# Altium schematic sheet Signal_RX.SchDoc: Signal_RX
size A4; DocumentNumber: 2; SheetNumber: 2; SheetTotal: 8
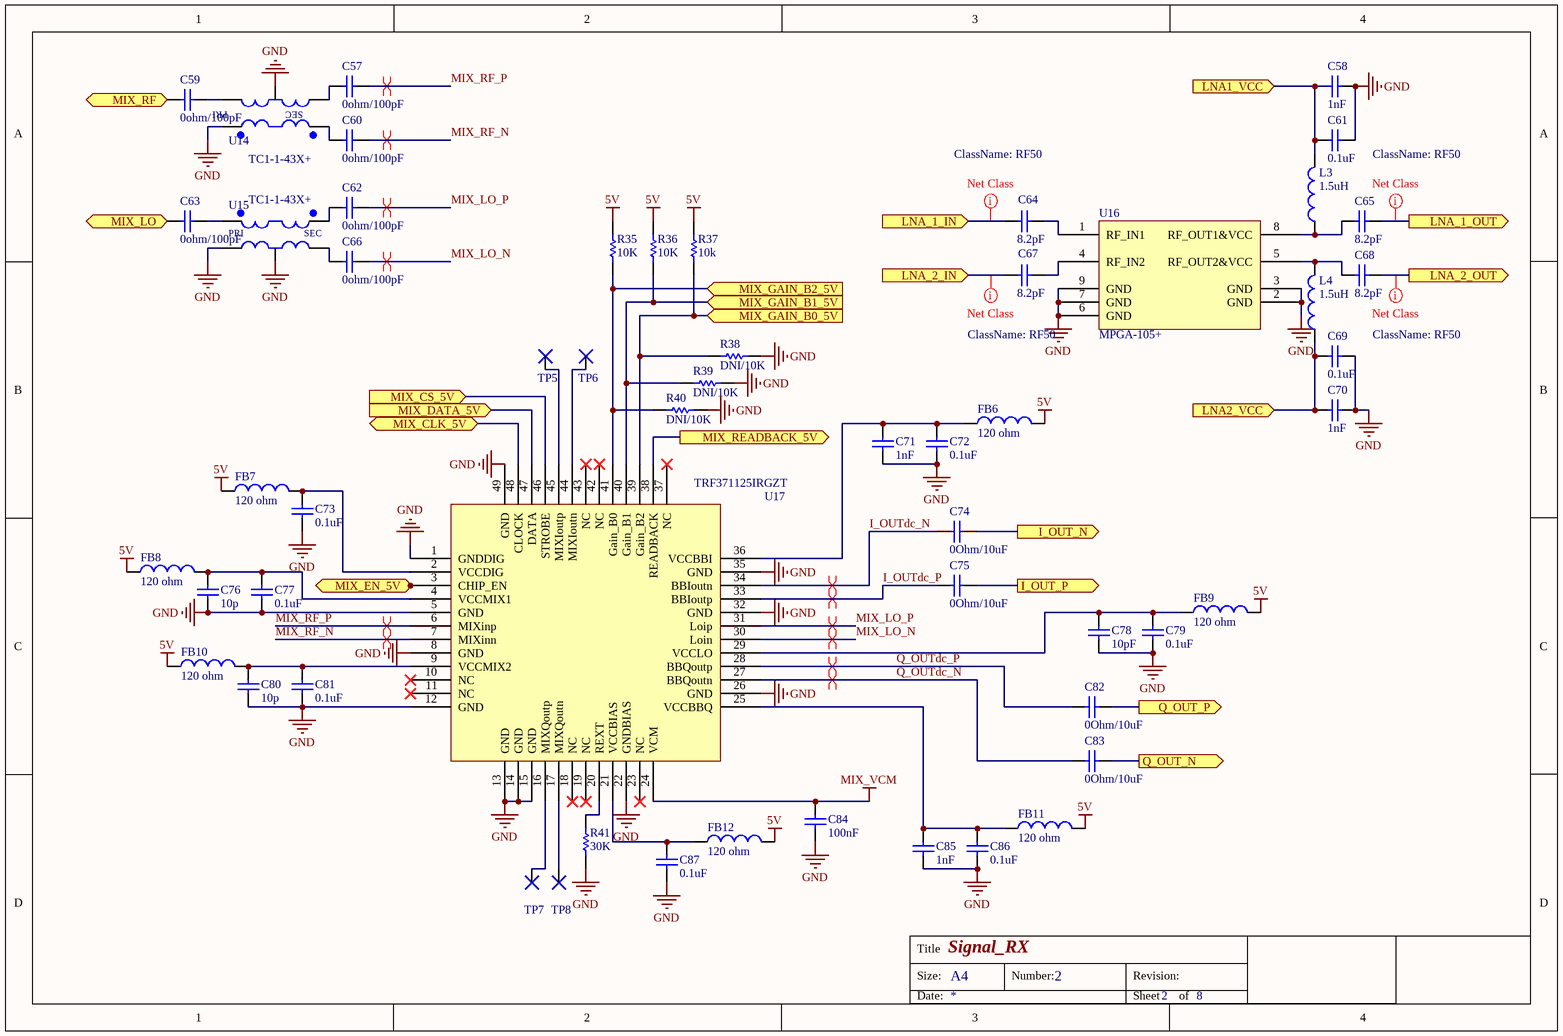
[diagram p0: Signal_RX.SchDoc]

## Parts
C57  0ohm/100pF  [0603 Cap]
C58  1nF  [0603 Cap]
C59  0ohm/100pF  [0603 Cap]
C60  0ohm/100pF  [0603 Cap]
C61  0.1uF  [0603 Cap]
C62  0ohm/100pF  [0603 Cap]
C63  0ohm/100pF  [0603 Cap]
C64  8.2pF  [Chip2PinSM127P600-8N_CAP0402]
C65  8.2pF  [Chip2PinSM127P600-8N_CAP0402]
C66  0ohm/100pF  [0603 Cap]
C67  8.2pF  [Chip2PinSM127P600-8N_CAP0402]
C68  8.2pF  [Chip2PinSM127P600-8N_CAP0402]
C69  0.1uF  [0603 Cap]
C70  1nF  [0603 Cap]
C71  1nF  [0603 Cap]
C72  0.1uF  [0603 Cap]
C73  0.1uF  [0603 Cap]
C74  0Ohm/10uF  [0603 Cap]
C75  0Ohm/10uF  [0603 Cap]
C76  10p  [0603 Cap]
C77  0.1uF  [0603 Cap]
C78  10pF  [0603 Cap]
C79  0.1uF  [0603 Cap]
C80  10p  [0603 Cap]
C81  0.1uF  [0603 Cap]
C82  0Ohm/10uF  [0603 Cap]
C83  0Ohm/10uF  [0603 Cap]
C84  100nF  [0603 Cap]
C85  1nF  [0603 Cap]
C86  0.1uF  [0603 Cap]
C87  0.1uF  [0603 Cap]
FB6  120 ohm  [INDC1608X08L]
FB7  120 ohm  [INDC1608X08L]
FB8  120 ohm  [INDC1608X08L]
FB9  120 ohm  [INDC1608X08L]
FB10  120 ohm  [INDC1608X08L]
FB11  120 ohm  [INDC1608X08L]
FB12  120 ohm  [INDC1608X08L]
L3  1.5uH  [INDC1008X07L]
L4  1.5uH  [INDC1008X07L]
R35  10K  [0603 Res]
R36  10K  [0603 Res]
R37  10k  [0603 Res]
R38  DNI/10K  [0603 Res]
R39  DNI/10K  [0603 Res]
R40  DNI/10K  [0603 Res]
R41  30K  [0603 Res]
TP5  TEST_POINT_PIN  [TESTPOINT]  (value not drawn)  (no BOM)
TP6  TEST_POINT_PIN  [TESTPOINT]  (value not drawn)  (no BOM)
TP7  TEST_POINT_PIN  [TESTPOINT]  (value not drawn)  (no BOM)
TP8  TEST_POINT_PIN  [TESTPOINT]  (value not drawn)  (no BOM)
U14  TC1-1-43X+  [AT1521]
U15  TC1-1-43X+  [AT1521]
U16  MPGA-105+  [DL1020_recomendedValues]
U17  TRF371125IRGZT  [QFN50P700X700X100_HS-49M]

## Ports
I_OUT_N (out), I_OUT_P (out), LNA1_VCC (in), LNA2_VCC (in), LNA_1_IN (in), LNA_1_OUT (out), LNA_2_IN (in), LNA_2_OUT (out), MIX_CLK_5V (bidir), MIX_CS_5V (in), MIX_DATA_5V (in), MIX_EN_5V (in), MIX_GAIN_B0_5V (in), MIX_GAIN_B1_5V (in), MIX_GAIN_B2_5V (in), MIX_LO (in), MIX_READBACK_5V (out), MIX_RF (in), Q_OUT_N (out), Q_OUT_P (out)

## Nets
5V: FB6.1 FB7.1 FB8.1 FB9.1 FB10.1 FB11.1 FB12.1 R35.2 R36.2 R37.2
GND: C58.1 C61.1 C69.2 C70.2 C71.2 C72.2 C73.1 C76.1 C77.1 C78.2 C79.2 C80.1 C81.1 C84.2 C85.2 C86.2 C87.2 R38.1 R39.1 R40.1 R41.1 U14.2(NC) U14.6 U15.2(NC) U15.4 U16.2(GND) U16.3(GND) U16.6(GND) U16.7(GND) U16.9(GND) U17.1(GNDDIG) U17.5(GND) U17.8(GND) U17.12(GND) U17.13(GND) U17.14(GND) U17.15(GND) U17.22(GNDBIAS) U17.26(GND) U17.32(GND) U17.35(GND) U17.49(GND)
MIX_VCM: C84.1 U17.24(VCM)
I_OUT_N: C74.1 ; port I_OUT_N
I_OUT_P: C75.1 ; port I_OUT_P
I_OUTdc_N: C74.2 U17.34(BBIoutn)
I_OUTdc_P: C75.2 U17.33(BBIoutp)
LNA1_VCC: C58.2 C61.2 L3.2 ; port LNA1_VCC
LNA2_VCC: C69.1 C70.1 L4.2 ; port LNA2_VCC
LNA_1_IN: C64.1 ; port LNA_1_IN
LNA_1_OUT: C65.2 ; port LNA_1_OUT
LNA_2_IN: C67.1 ; port LNA_2_IN
LNA_2_OUT: C68.2 ; port LNA_2_OUT
MIX_CLK_5V: U17.48(CLOCK) ; port MIX_CLK_5V
MIX_CS_5V: U17.46(STROBE) ; port MIX_CS_5V
MIX_DATA_5V: U17.47(DATA) ; port MIX_DATA_5V
MIX_GAIN_B0_5V: R37.1 R38.2 U17.39(Gain_B2) ; port MIX_GAIN_B0_5V
MIX_GAIN_B1_5V: R36.1 R39.2 U17.40(Gain_B1) ; port MIX_GAIN_B1_5V
MIX_GAIN_B2_5V: R35.1 R40.2 U17.41(Gain_B0) ; port MIX_GAIN_B2_5V
MIX_LO: C63.1 ; port MIX_LO
MIX_LO_N: C66.2 U17.30(Loin)
MIX_LO_P: C62.2 U17.31(Loip)
MIX_READBACK_5V: U17.38(READBACK) ; port MIX_READBACK_5V
MIX_RF: C59.1 ; port MIX_RF
MIX_RF_N: C60.2 U17.7(MIXinn)
MIX_RF_P: C57.2 U17.6(MIXinp)
Q_OUT_N: C83.1 ; port Q_OUT_N
Q_OUT_P: C82.1 ; port Q_OUT_P
Q_OUTdc_N: C83.2 U17.27(BBQoutn)
Q_OUTdc_P: C82.2 U17.28(BBQoutp)
NetC57_1: C57.1 U14.3
NetC59_2: C59.2 U14.4
NetC60_1: C60.1 U14.1
NetC62_1: C62.1 U15.1
NetC63_2: C63.2 U15.6
NetC64_2: C64.2 U16.1(RF_IN1)
NetC65_1: C65.1 L3.1 U16.8(RF_OUT1&VCC)
NetC66_1: C66.1 U15.3
NetC67_2: C67.2 U16.4(RF_IN2)
NetC68_1: C68.1 L4.1 U16.5(RF_OUT2&VCC)
NetC71_1: C71.1 C72.1 FB6.2 U17.36(VCCBBI)
NetC73_2: C73.2 FB7.2 U17.2(VCCDIG)
NetC76_2: C76.2 C77.2 FB8.2 U17.4(VCCMIX1)
NetC78_1: C78.1 C79.1 FB9.2 U17.29(VCCLO)
NetC80_2: C80.2 C81.2 FB10.2 U17.9(VCCMIX2)
NetC85_1: C85.1 C86.1 FB11.2 U17.25(VCCBBQ)
NetC87_1: C87.1 FB12.2 U17.21(VCCBIAS)
NetR41_2: R41.2 U17.20(REXT)
NetTP5_1: TP5.1 U17.45(MIXIoutp)
NetTP6_1: TP6.1 U17.44(MIXIoutn)
NetTP7_1: TP7.1 U17.16(MIXQoutp)
NetTP8_1: TP8.1 U17.17(MIXQoutn)

Not connected (* = marked no-connect by the designer): U17 3(CHIP_EN) 10(NC)* 11(NC)* 18(NC)* 19(NC)* 23(NC)* 37(NC)* 42(NC)* 43(NC)*

## Layout directives
differential pair: I_OUTdc_N, I_OUTdc_P, MIX_LO_N, MIX_LO_P, MIX_RF_N, MIX_RF_P, Q_OUTdc_N, Q_OUTdc_P
net class RF50: LNA_1_IN, LNA_1_OUT, LNA_2_IN, LNA_2_OUT

## Notes on the sheet
- Title
- Size:
- A4
- Number:
- Revision:
- Date:
- Sheet
- of
- (in symbol TC1-1-43X+) PRI; SEC

## Library data of the parts
C57-C63 C66 C69-C87 = C_0603: CAP CER 16V X7R 0603; Tolerance: 10; Voltage Rating: 16; Material: Ceramic; Mount: Surface Mount; Case/Package: 0603; Case Code (Metric): 1608; Case Code (Imperial): 0603; Capacitance: *; Dielectric: X7R; Voltage Rating (DC): 16; Termination: SMD; Composition: Ceramic; Voltage: 16; Length: 1.6; Height: 0.8; Width: 0.8; Thickness: 0.035; Depth: 0.8
C64 C65 C67 C68 = 04025A8R2BAT2A: CAP CER 8.2PF 50V NP0 0402; Manufacturer: AVX Corporation; Tolerance: ±0.1pF; Temperature Coefficient: C0G, NP0; Notification: Current market demand for these product types have resulted in fluctuating and extending lead times. Lead times may differ.; Supplier 1: Digi-Key; Manufacturer Part Number: 04025A8R2BAT2A; RoHS: RoHS Compliant; Category: Capacitors; Stock 1: 20781; Pricing 1: 1=0.09, 10=0.046, 100=0.0204, 500=0.0146, 1000=0.01148, 2500=0.01043, 5000=0.0096 (EUR); Packaging: Cut Tape (CT); Part Status: Active; Voltage - Rated: 50V; Operating Temperature: -55°C ~ 125°C; Features: -; Ratings: -; Applications: General Purpose; Failure Rate: -; Mounting Type: Surface Mount, MLCC; Package / Case: 0402 (1005 Metric); Size / Dimension: 0.039" L x 0.020" W (1.00mm x 0.50mm); Height - Seated (Max): -; Thickness (Max): 0.022" (0.56mm); Lead Spacing: -; Lead Style: -; ComponentLink1URL: http://datasheets.avx.com/C0GNP0-Dielectric.pdf; ComponentLink1Description: http://datasheets.avx.com/C0GNP0-Dielectric.pdf; Supplier Part Number 1: 478-10785-1-ND
FB6-FB12 = BLM18PG121SN1D: FERRITE BEAD 120 OHM 0603 1LN; Manufacturer: Murata Electronics North America; Filter Type: Power Line; Number of Lines: 1; Impedance @ Frequency: 120 Ohm @ 100MHz; Current Rating (Max): 2A; DC Resistance (DCR) (Max): 50 mOhm; Supplier 1: Digi-Key; Manufacturer Part Number: BLM18PG121SN1D; RoHS: RoHS Compliant; Category: Filters; Stock 1: 1305577; Pricing 1: 1=0.09, 10=0.067, 25=0.06, 50=0.0438, 100=0.038, 250=0.02996, 500=0.0253, 1000=0.02132 (EUR); Packaging: Cut Tape (CT); Part Status: Active; Ratings: -; Operating Temperature: -55°C ~ 125°C; Package / Case: 0603 (1608 Metric); Mounting Type: Surface Mount; Height (Max): 0.037" (0.95mm); Size / Dimension: 0.063" L x 0.031" W (1.60mm x 0.80mm); ComponentLink1URL: http://www.murata.com/en-us/products/productdata/8796738650142/ENFA0003.pdf; ComponentLink1Description: http://www.murata.com/en-us/products/productdata/8796738650142/ENFA0003.pdf; Supplier Part Number 1: 490-1037-1-ND
L3 L4 = AISC-1008F-1R5G-T: FIXED IND 1.5UH 630MA 760 MOHM; Manufacturer: Abracon LLC; Type: Wirewound; Material - Core: Ferrite; Tolerance: ±2%; Shielding: Unshielded; DC Resistance (DCR): 760 mOhm Max; Q @ Freq: 35 @ 50MHz; Frequency - Self Resonant: 190MHz; Supplier 1: Digi-Key; Manufacturer Part Number: AISC-1008F-1R5G-T; RoHS: RoHS Compliant; Category: Inductors, Coils, Chokes; Stock 1: 42157; Pricing 1: 1=0.31, 10=0.275, 100=0.189, 500=0.16152, 1000=0.12372 (EUR); Packaging: Cut Tape (CT); Part Status: Active; Current - Saturation: -; Ratings: -; Operating Temperature: -40°C ~ 85°C; Mounting Type: Surface Mount; Package / Case: 1008 (2520 Metric); Supplier Device Package: 1008 (2520 Metric); Size / Dimension: 0.115" L x 0.110" W (2.92mm x 2.79mm); Height - Seated (Max): 0.090" (2.29mm); ComponentLink1URL: https://abracon.com/Magnetics/new/AISC-1008F(L).pdf; ComponentLink1Description: https://abracon.com/Magnetics/new/AISC-1008F(L).pdf; Supplier Part Number 1: AISC-1008F-1R5G-TCT-ND
R35-R41 = R_0603: SMD Resistor, 1%, 0.1W, 0603; Tolerance: 1; Power Rating: 100; Mount: Surface Mount; Case/Package: 0603; Pins: 2; Case Code (Imperial): 0603; Case Code (Metric): 1608; Termination: SMD; Length: 1.6; Height: 0.45; Width: 0.8; Depth: 0.8
TP5-TP8 = TEST_POINT_PIN: Test point for single pin
U14 U15 = TC1-1-43X+: SMD RF Transformer; Manufacturer: Minicircuits; Manufacturer Part Number: TC1-1-43X+; Supplier: Aicox
U16 = MPGA-105+: Dual Matched MMIC Ampli er; Manufacturer: Minicircuits; Manufacturer Part Number: MPGA-105+; Supplier: Aicox
U17 = TRF371125IRGZT: IC IQ DEMODULATOR W/PGA 48VQFN; Manufacturer: Texas Instruments; Function: Demodulator, Amplifier; LO Frequency: 700MHz ~ 4GHz; P1dB: 3dBm; Gain: 40dB; Noise Figure: 13.5dB; Voltage - Supply: 4.5 V ~ 5.5 V; Supplier 1: Digi-Key; Manufacturer Part Number: TRF371125IRGZT; RoHS: RoHS Compliant; Category: RF/IF and RFID; Stock 1: 1365; Pricing 1: 1=22.67, 10=20.922, 25=19.1784, 100=17.7254 (EUR); Packaging: Cut Tape (CT); Part Status: Active; RF Frequency: 700MHz ~ 4GHz; Package / Case: 48-VFQFN Exposed Pad; Supplier Device Package: 48-VQFN (7x7); ComponentLink1URL: http://www.ti.com/lit/ds/symlink/trf371125.pdf; ComponentLink1Description: http://www.ti.com/lit/ds/symlink/trf371125.pdf; Supplier Part Number 1: 296-25654-1-ND; Supplier: Aicox